# Altium schematic sheet Ana_5V.SchDoc
size A4
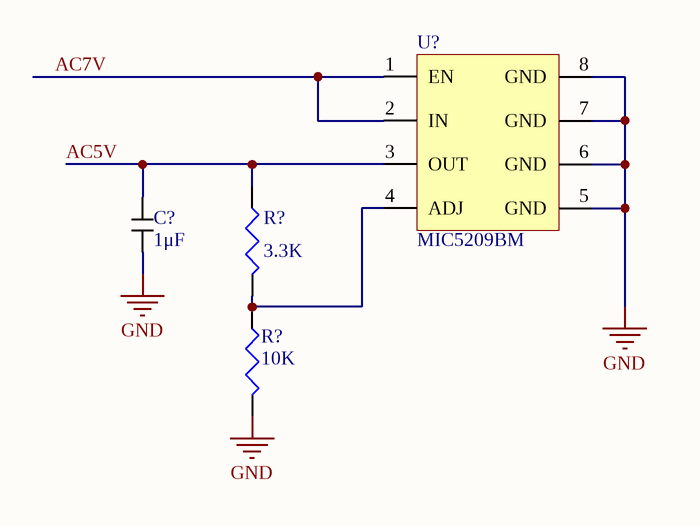
[diagram p0: Ana_5V.SchDoc]

## Parts
(Parts that share a designator on the sheet are numbered #1, #2 ... from top to bottom, then left to right.)
C?  1μF  [0603]
R?#1  value 3.3K  [J1-0603]  (hidden comment: Res3)
R?#2  value 10K  [J1-0603]  (hidden comment: Res3)
U?  MIC5209BM

## Nets
GND: R?#2.2 U?.5(GND) U?.6(GND) U?.7(GND) U?.8(GND)
AC5V: R?#1.1 U?.3(OUT)
AC7V: U?.1(EN) U?.2(IN)
NetR?#1_2: R?#1.2 R?#2.1 U?.4(ADJ)

## Library data of the parts
C? = Cap 0603
R?#1 R?#2 = Res3: Resistor; Published: 8-Jun-2000; LatestRevisionDate: 29-May-2009; LatestRevisionNote: IPC-7351 Footprint Added.; PackageReference: J1-0603; Publisher: Altium Limited; PackageDescription: Chip Resistor